# EAGLE design photo-trigger (EAGLE 6.6.0)

## Sheet 1 of 4
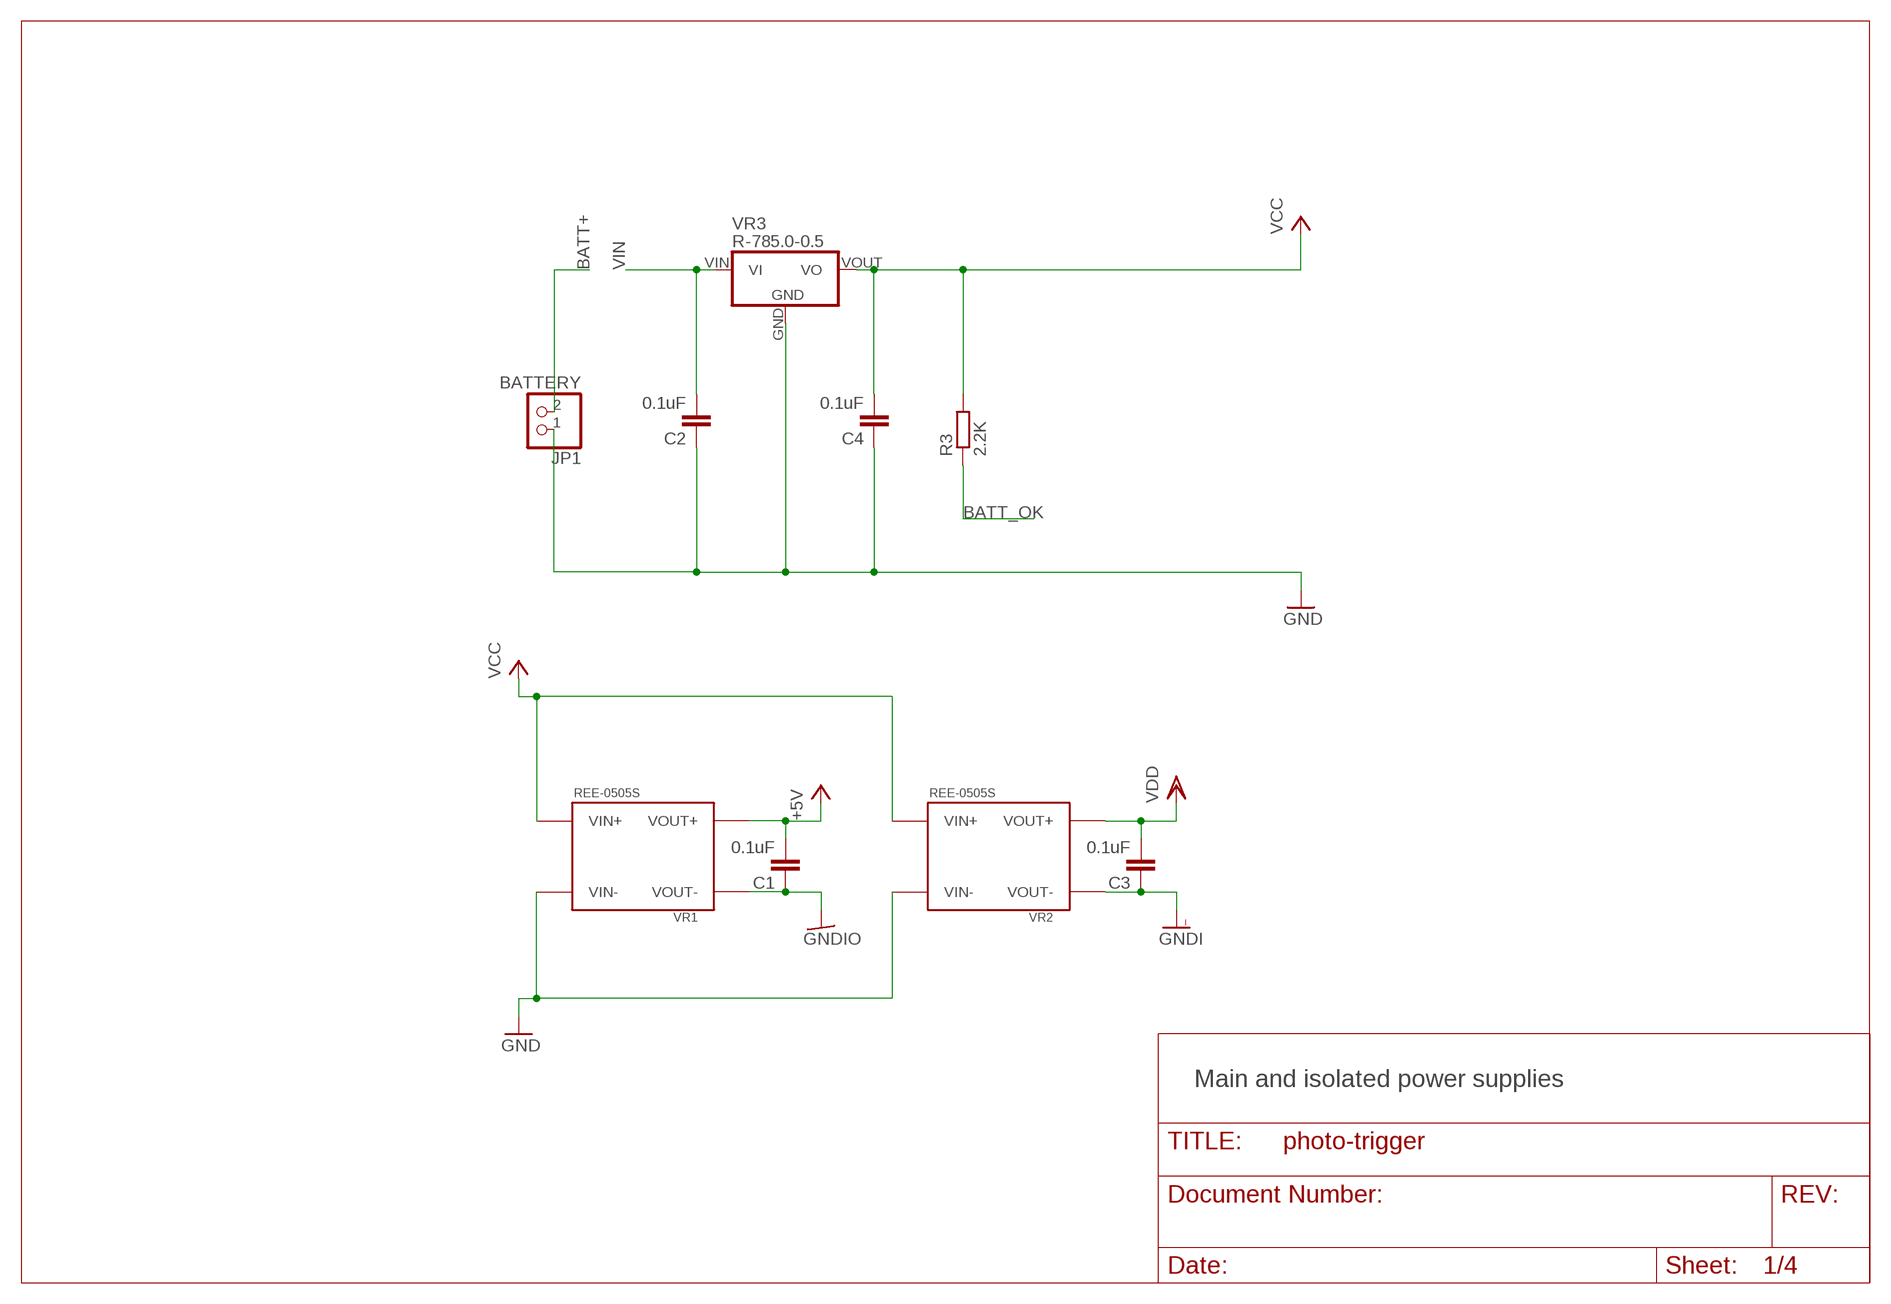
[diagram p0: schematic, sheet 1]

### Parts
C1  0.1uF  C-EU050-035X075  [C050-035X075]
C2  0.1uF  C-EU050-035X075  [C050-035X075]
C3  0.1uF  C-EU050-035X075  [C050-035X075]
C4  0.1uF  C-EU050-035X075  [C050-035X075]
JP1  BATTERY  PINHD-1X2  [1X02]
R3  2.2K  R-EU_0207/10  [0207/10]
VR1  REE-0505S  RECOM-REE-0505S  [RECOM-REE]
VR2  REE-0505S  RECOM-REE-0505S  [RECOM-REE]
VR3  R-785.0-0.5  RECOM-R-785.0-0.5  [RECOM-R78]

### Nets
+5V [power]: C1.2 VR1.VOUT+ ; also sheet 4
BATT+ [power]: JP1.2 ; also sheet 4
BATT_OK: R3.1 ; also sheet 4
GND [power]: C2.1 C4.1 JP1.1 VR1.VIN- VR2.VIN- VR3.GND ; also sheet 2,3,4
GNDI [power]: C3.1 VR2.VOUT- ; also sheet 4
GNDIO [power]: C1.1 VR1.VOUT- ; also sheet 2,4
VCC [power]: C4.2 R3.2 VR1.VIN+ VR2.VIN+ VR3.VOUT(VO) ; also sheet 2,3,4
VDD [power]: C3.2 VR2.VOUT+ ; also sheet 4
VIN [power]: C2.2 VR3.VIN(VI) ; also sheet 4

### Notes on the sheet
- Main and isolated power supplies

## Sheet 2 of 4
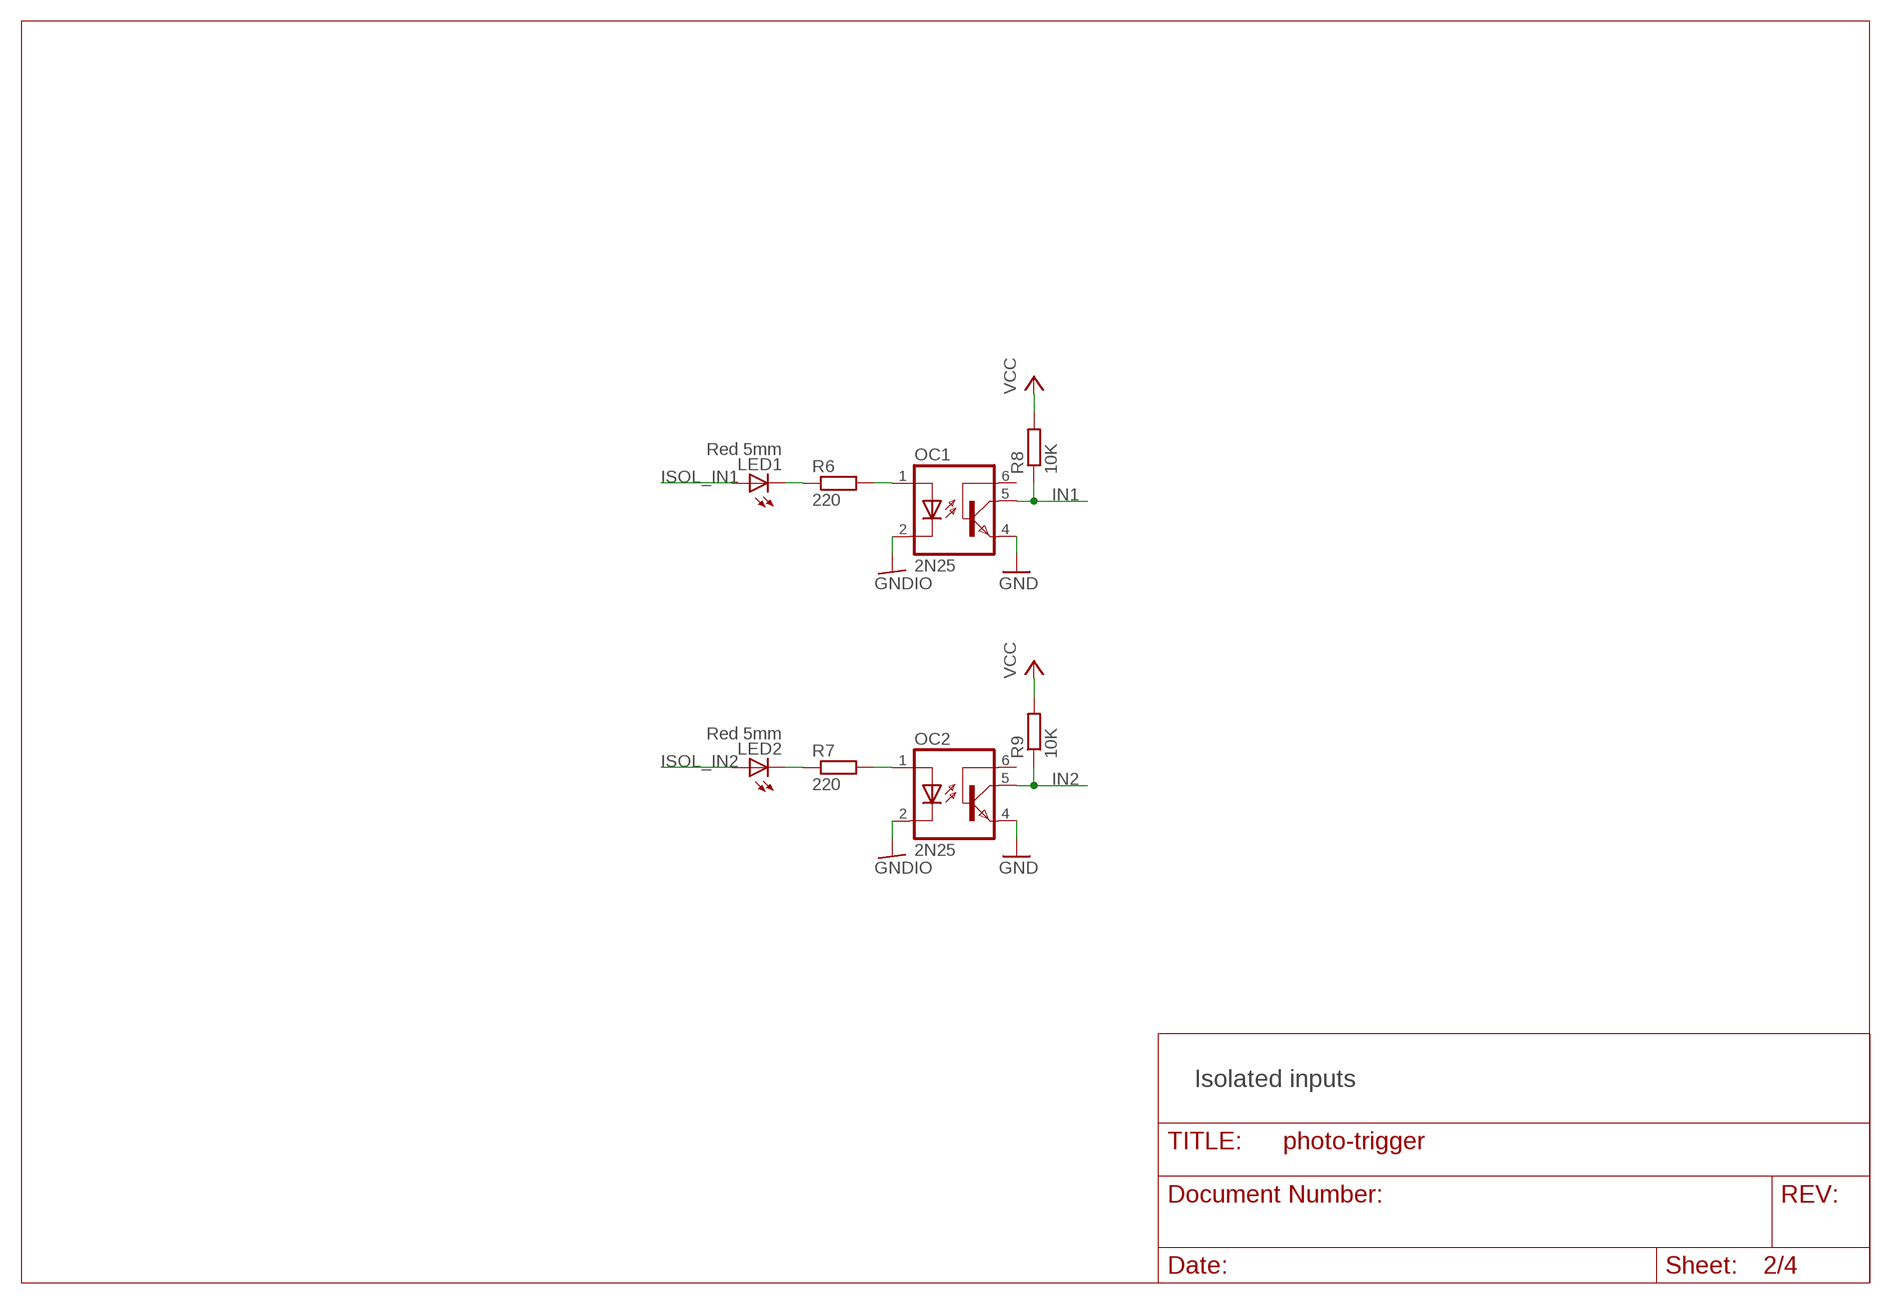
[diagram p1: schematic, sheet 2]

### Parts
LED1  Red 5mm  LED5MM  [LED5MM]
LED2  Red 5mm  LED5MM  [LED5MM]
OC1  2N25  [DIL-06]
OC2  2N25  [DIL-06]
R6  220  R-EU_0207/10  [0207/10]
R7  220  R-EU_0207/10  [0207/10]
R8  10K  R-EU_0207/10  [0207/10]
R9  10K  R-EU_0207/10  [0207/10]

### Nets
GND [power]: OC1.4(EMI) OC2.4(EMI) ; also sheet 1,3,4
GNDIO [power]: OC1.2(C) OC2.2(C) ; also sheet 1,4
IN1: OC1.5(COL) R8.1 ; also sheet 3
IN2: OC2.5(COL) R9.1 ; also sheet 3
ISOL_IN1: LED1.A ; also sheet 4
ISOL_IN2: LED2.A ; also sheet 4
N$1: OC1.1(A) R6.2
N$2: OC2.1(A) R7.2
N$3: LED2.K(C) R7.1
N$4: LED1.K(C) R6.1
VCC [power]: R8.2 R9.2 ; also sheet 1,3,4
Unconnected: OC1.6(BAS) OC2.6(BAS)

### Notes on the sheet
- Isolated inputs

## Sheet 3 of 4
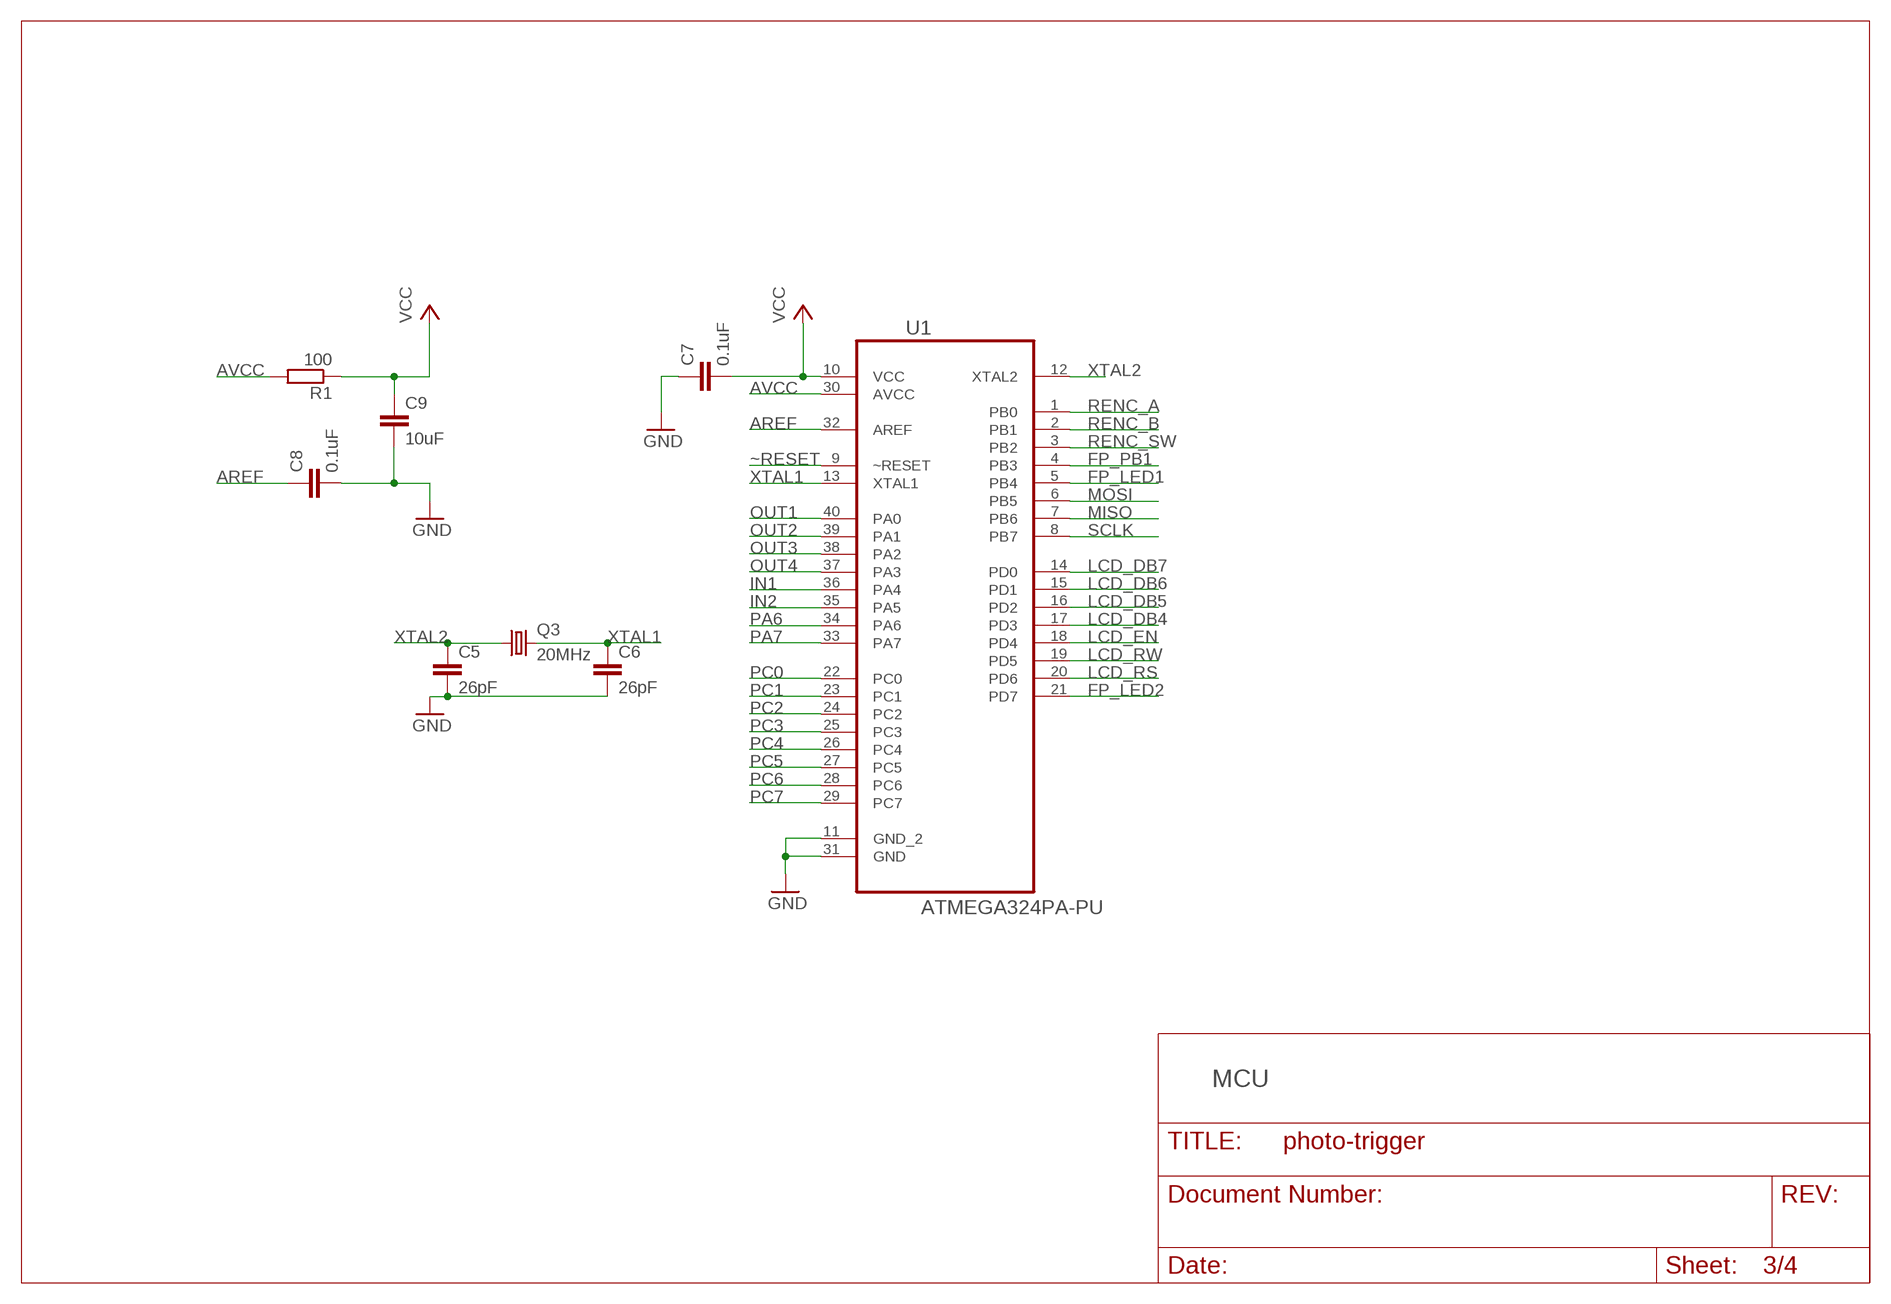
[diagram p2: schematic, sheet 3]

### Parts
C5  26pF  C-EU025-025X050  [C025-025X050]
C6  26pF  C-EU025-025X050  [C025-025X050]
C7  0.1uF  C-EU050-035X075  [C050-035X075]
C8  0.1uF  C-EU050-035X075  [C050-035X075]
C9  10uF  C-EU050-035X075  [C050-035X075]
Q3  20MHz  CRYSTALHC49S  [HC49/S]
R1  100  R-EU_0207/10  [0207/10]
U1  ATMEGA324PA-PU  [DIP254P1524X482-40]

### Nets
AREF: C8.1 U1.32(AREF)
AVCC: R1.2 U1.30(AVCC)
FP_LED1: U1.5(PB4) ; also sheet 4
FP_LED2: U1.21(PD7) ; also sheet 4
FP_PB1: U1.4(PB3) ; also sheet 4
GND [power]: C5.2 C6.2 C7.1 C8.2 C9.2 U1.11(GND_2) U1.31(GND) ; also sheet 1,2,4
IN1: U1.36(PA4) ; also sheet 2
IN2: U1.35(PA5) ; also sheet 2
LCD_DB4: U1.17(PD3) ; also sheet 4
LCD_DB5: U1.16(PD2) ; also sheet 4
LCD_DB6: U1.15(PD1) ; also sheet 4
LCD_DB7: U1.14(PD0) ; also sheet 4
LCD_EN: U1.18(PD4) ; also sheet 4
LCD_RS: U1.20(PD6) ; also sheet 4
LCD_RW: U1.19(PD5) ; also sheet 4
MISO: U1.7(PB6) ; also sheet 4
MOSI: U1.6(PB5) ; also sheet 4
OUT1: U1.40(PA0) ; also sheet 4
OUT2: U1.39(PA1) ; also sheet 4
OUT3: U1.38(PA2) ; also sheet 4
OUT4: U1.37(PA3) ; also sheet 4
PA6: U1.34(PA6) ; also sheet 4
PA7: U1.33(PA7) ; also sheet 4
PC0: U1.22(PC0) ; also sheet 4
PC1: U1.23(PC1) ; also sheet 4
PC2: U1.24(PC2) ; also sheet 4
PC3: U1.25(PC3) ; also sheet 4
PC4: U1.26(PC4) ; also sheet 4
PC5: U1.27(PC5) ; also sheet 4
PC6: U1.28(PC6) ; also sheet 4
PC7: U1.29(PC7) ; also sheet 4
RENC_A: U1.1(PB0) ; also sheet 4
RENC_B: U1.2(PB1) ; also sheet 4
RENC_SW: U1.3(PB2) ; also sheet 4
SCLK: U1.8(PB7) ; also sheet 4
VCC [power]: C7.2 C9.1 R1.1 U1.10(VCC) ; also sheet 1,2,4
XTAL1: C6.1 Q3.2 U1.13(XTAL1)
XTAL2: C5.1 Q3.1 U1.12(XTAL2)
~RESET: U1.9(~RESET) ; also sheet 4

### Notes on the sheet
- MCU

## Sheet 4 of 4
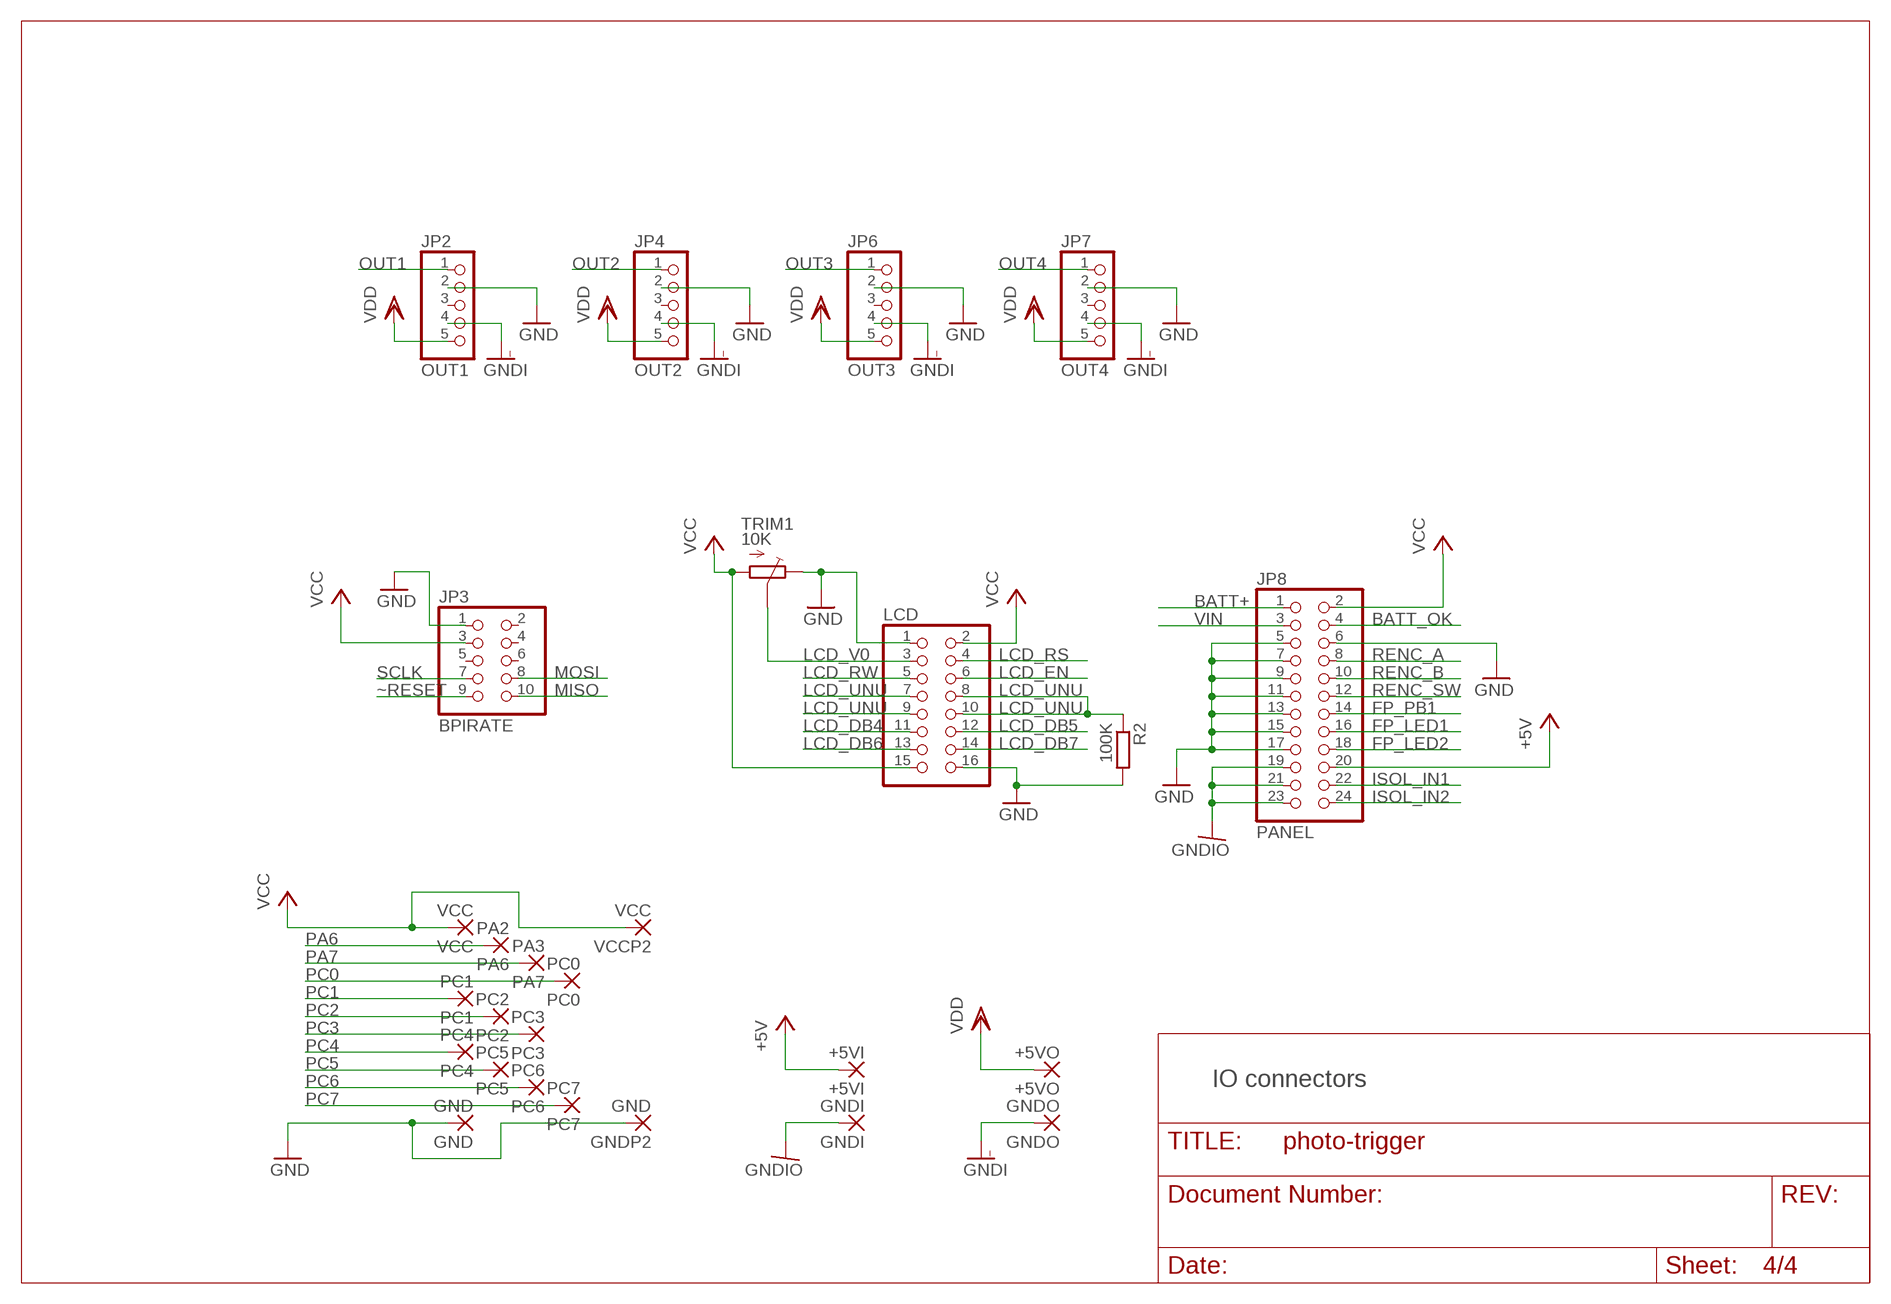
[diagram p3: schematic, sheet 4]

### Parts
+5VI  +5VI  1,6/0,9  [1,6/0,9]
+5VO  +5VO  1,6/0,9  [1,6/0,9]
GND  GND  1,6/0,9  [1,6/0,9]
GNDI  GNDI  1,6/0,9  [1,6/0,9]
GNDO  GNDO  1,6/0,9  [1,6/0,9]
GNDP2  GND  1,6/0,9  [1,6/0,9]
JP2  OUT1  PINHD-1X5  [1X05]
JP3  BPIRATE  PINHD-2X5  [2X05]
JP4  OUT2  PINHD-1X5  [1X05]
JP6  OUT3  PINHD-1X5  [1X05]
JP7  OUT4  PINHD-1X5  [1X05]
JP8  PANEL  PINHD-2X12  [2X12]
LCD  PINHD-2X8  [2X08]
PA6  PA2  1,6/0,9  [1,6/0,9]
PA7  PA3  1,6/0,9  [1,6/0,9]
PC0  PC0  1,6/0,9  [1,6/0,9]
PC1  PC1  1,6/0,9  [1,6/0,9]
PC2  PC2  1,6/0,9  [1,6/0,9]
PC3  PC3  1,6/0,9  [1,6/0,9]
PC4  PC4  1,6/0,9  [1,6/0,9]
PC5  PC5  1,6/0,9  [1,6/0,9]
PC6  PC6  1,6/0,9  [1,6/0,9]
PC7  PC7  1,6/0,9  [1,6/0,9]
R2  100K  R-EU_0207/10  [0207/10]
TRIM1  10K  VISHAY-63M-T607  [VISHAY-TRIM-63M-T607]
VCC  VCC  1,6/0,9  [1,6/0,9]
VCCP2  VCC  1,6/0,9  [1,6/0,9]

### Nets
+5V [power]: +5VI.1(P) JP8.20 ; also sheet 1
BATT+ [power]: JP8.1 ; also sheet 1
BATT_OK: JP8.4 ; also sheet 1
FP_LED1: JP8.16 ; also sheet 3
FP_LED2: JP8.18 ; also sheet 3
FP_PB1: JP8.14 ; also sheet 3
GND [power]: GND.1(P) GNDP2.1(P) JP2.2 JP3.1 JP4.2 JP6.2 JP7.2 JP8.5 JP8.6 JP8.7 JP8.9 JP8.11 JP8.13 JP8.15 JP8.17 LCD.1 LCD.16 R2.2 TRIM1.P$3(E) ; also sheet 1,2,3
GNDI [power]: GNDO.1(P) JP2.4 JP4.4 JP6.4 JP7.4 ; also sheet 1
GNDIO [power]: GNDI.1(P) JP8.19 JP8.21 JP8.23 ; also sheet 1,2
ISOL_IN1: JP8.22 ; also sheet 2
ISOL_IN2: JP8.24 ; also sheet 2
LCD_DB4: LCD.11 ; also sheet 3
LCD_DB5: LCD.12 ; also sheet 3
LCD_DB6: LCD.13 ; also sheet 3
LCD_DB7: LCD.14 ; also sheet 3
LCD_EN: LCD.6 ; also sheet 3
LCD_RS: LCD.4 ; also sheet 3
LCD_RW: LCD.5 ; also sheet 3
LCD_UNU: LCD.7 LCD.8 LCD.9 LCD.10 R2.1
LCD_V0: LCD.3 TRIM1.P$2(S)
MISO: JP3.10 ; also sheet 3
MOSI: JP3.8 ; also sheet 3
OUT1: JP2.1 ; also sheet 3
OUT2: JP4.1 ; also sheet 3
OUT3: JP6.1 ; also sheet 3
OUT4: JP7.1 ; also sheet 3
PA6: PA6.1(P) ; also sheet 3
PA7: PA7.1(P) ; also sheet 3
PC0: PC0.1(P) ; also sheet 3
PC1: PC1.1(P) ; also sheet 3
PC2: PC2.1(P) ; also sheet 3
PC3: PC3.1(P) ; also sheet 3
PC4: PC4.1(P) ; also sheet 3
PC5: PC5.1(P) ; also sheet 3
PC6: PC6.1(P) ; also sheet 3
PC7: PC7.1(P) ; also sheet 3
RENC_A: JP8.8 ; also sheet 3
RENC_B: JP8.10 ; also sheet 3
RENC_SW: JP8.12 ; also sheet 3
SCLK: JP3.7 ; also sheet 3
VCC [power]: JP3.3 JP8.2 LCD.2 LCD.15 TRIM1.P$1(A) VCC.1(P) VCCP2.1(P) ; also sheet 1,2,3
VDD [power]: +5VO.1(P) JP2.5 JP4.5 JP6.5 JP7.5 ; also sheet 1
VIN [power]: JP8.3 ; also sheet 1
~RESET: JP3.9 ; also sheet 3
Unconnected: JP2.3 JP3.2 JP3.4 JP3.5 JP3.6 JP4.3 JP6.3 JP7.3

### Notes on the sheet
- IO connectors

## Library data of the parts
+5VI +5VO GND GNDI GNDO GNDP2 PA6 PA7 PC0 PC1-PC7 VCC VCCP2 = wirepad:1,6/0,9: THROUGH-HOLE PAD
C1-C9 = rcl:C-EU: CAPACITOR, European symbol
JP1 = pinhead:PINHD-1X2: PIN HEADER
JP2 JP4 JP6 JP7 = pinhead:PINHD-1X5: PIN HEADER
JP3 = pinhead:PINHD-2X5: PIN HEADER
JP8 = pinhead:PINHD-2X12: PIN HEADER
LCD = pinhead:PINHD-2X8: PIN HEADER
LED1 LED2 = led:LED: LED OSRAM: - CHIPLED LG R971, LG N971, LY N971, LG Q971, LY Q971, LO R971, LY R971 LH N974, LH R974 LS Q976, LO Q976, LY Q976 LO Q996 - Hyper CHIPLED LW Q18S LB Q993, LB Q99A, LB R99A - SideLED LS A670, LO A670, LY A670, LG A670, LP A670 LB A673, LV A673, LT A673, LW A673 LH A674 LY A675 LS A676, LA A676, LO A676, LY A676, LW A676 LS A679, LY A679, LG A679 - Hyper Micro SIDELED® LS Y876, LA Y876, LO Y876, LY Y876 LT Y87S - SmartLED LW L88C, LW L88S LB L89C, LB L89S, LG L890 LS L89K, LO L89K, LY L89K LS L896, LA L896, LO L896, LY L896 - TOPLED LS T670, LO T670, LY T670, LG T670, LP T670 LSG T670, LSP T670, LSY T670, LOP T670, LYG T670 LG T671, LOG T671, LSG T671 LB T673, LV T673, LT T673, LW T673 LH T674 LS T676, LA T676, LO T676, LY T676, LB T676, LH T676, LSB T676, LW T676 LB T67C, LV T67C, LT T67C, LS T67K, LO T67K, LY T67K, LW E67C LS E67B, LA E67B, LO E67B, LY E67B, LB E67C, LV E67C, LT E67C LW T67C LS T679, LY T679, LG T679 LS T770, LO T770, LY T770, LG T770, LP T770 LB T773, LV T773, LT T773, LW T773 LH T774 LS E675, LA E675, LY E675, LS T675 LS T776, LA T776, LO T776, LY T776, LB T776 LHGB T686 LT T68C, LB T68C - Hyper Mini TOPLED® LB M676 - Mini TOPLED Santana® LG M470 LS M47K, LO M47K, LY M47K Source: http://www.osram.convergy.de LUXEON: - LUMILED® LXK2-PW12-R00, LXK2-PW12-S00, LXK2-PW14-U00, LXK2-PW14-V00 LXK2-PM12-R00, LXK2-PM12-S00, LXK2-PM14-U00 LXK2-PE12-Q00, LXK2-PE12-R00, LXK2-PE12-S00, LXK2-PE14-T00, LXK2-PE14-U00 LXK2-PB12-K00, LXK2-PB12-L00, LXK2-PB12-M00, LXK2-PB14-N00, LXK2-PB14-P00, LXK2-PB14-Q00 LXK2-PR12-L00, LXK2-PR12-M00, LXK2-PR14-Q00, LXK2-PR14-R00 LXK2-PD12-Q00, LXK2-PD12-R00, LXK2-PD12-S00 LXK2-PH12-R00, LXK2-PH12-S00 LXK2-PL12-P00, LXK2-PL12-Q00, LXK2-PL12-R00 Source: www.luxeon.com KINGBRIGHT: KA-3528ASYC Source: www.kingbright.com
OC1 OC2 = djm:2N25: 2N25 NPN optocoupler
Q3 = crystal:CRYSTAL: CRYSTAL; OC_FARNELL: 1667008; OC_NEWARK: unknown
R1-R3 = rcl:R-EU_: RESISTOR, European symbol
R6-R9 = resistor:R-EU_: RESISTOR, European symbol
TRIM1 = djm:VISHAY-63M-T607: Vishay Spectrol M63*T607 single-turn trimpot http://www.vishay.com/docs/57027/63.pdf
U1 = Atmel_By_element14_Batch_1-00:ATMEGA324PA-PU: 8-bit MCU; MPN: ATMEGA324PA-PU; OC_FARNELL: 1715485; OC_NEWARK: 15R0267; PACKAGE: DIP-40; SUPPLIER: ATMEL
VR1 VR2 = djm:RECOM-REE-0505S: RECOM REE-0505S Isolating DC/DC converter. Output 5VDC 200mA. Input 5VDC http://docs-asia.electrocomponents.com/webdocs/11da/0900766b811da244.pdf
VR3 = djm:RECOM-R-785.0-0.5: Recom R-785.0-0.5 Switching regulator. Output: 5V 500mA. Input 6.5-32V. http://docs-asia.electrocomponents.com/webdocs/063c/0900766b8063c4d2.pdf

## Net classes
1 power: width 1.27 mm

## Board
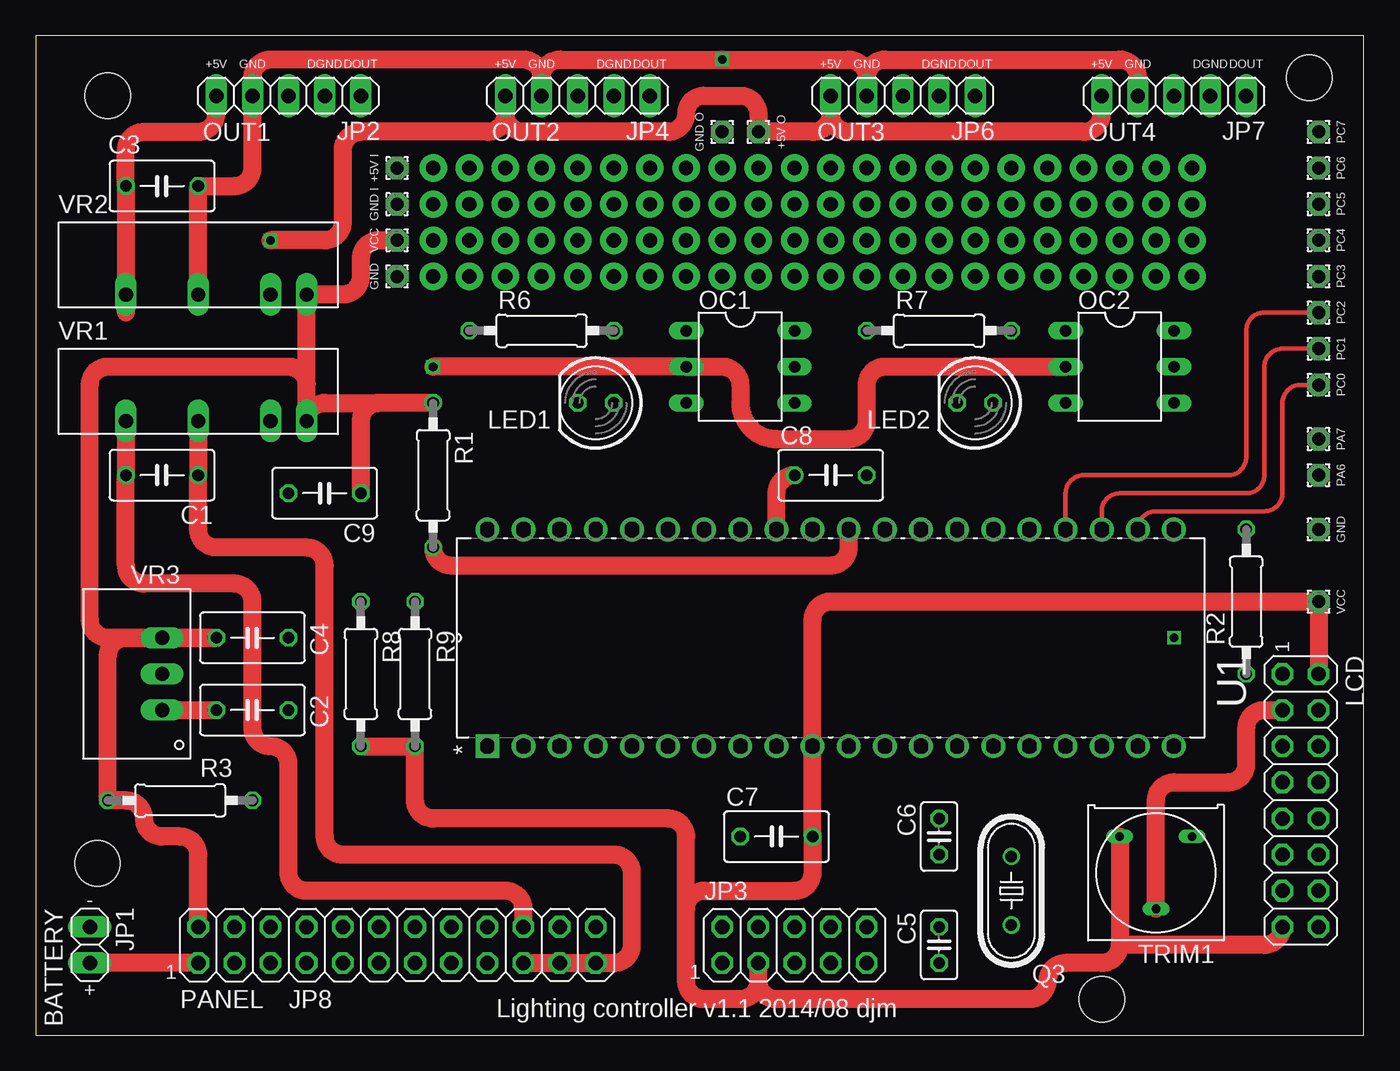
[diagram p4: board, top side]
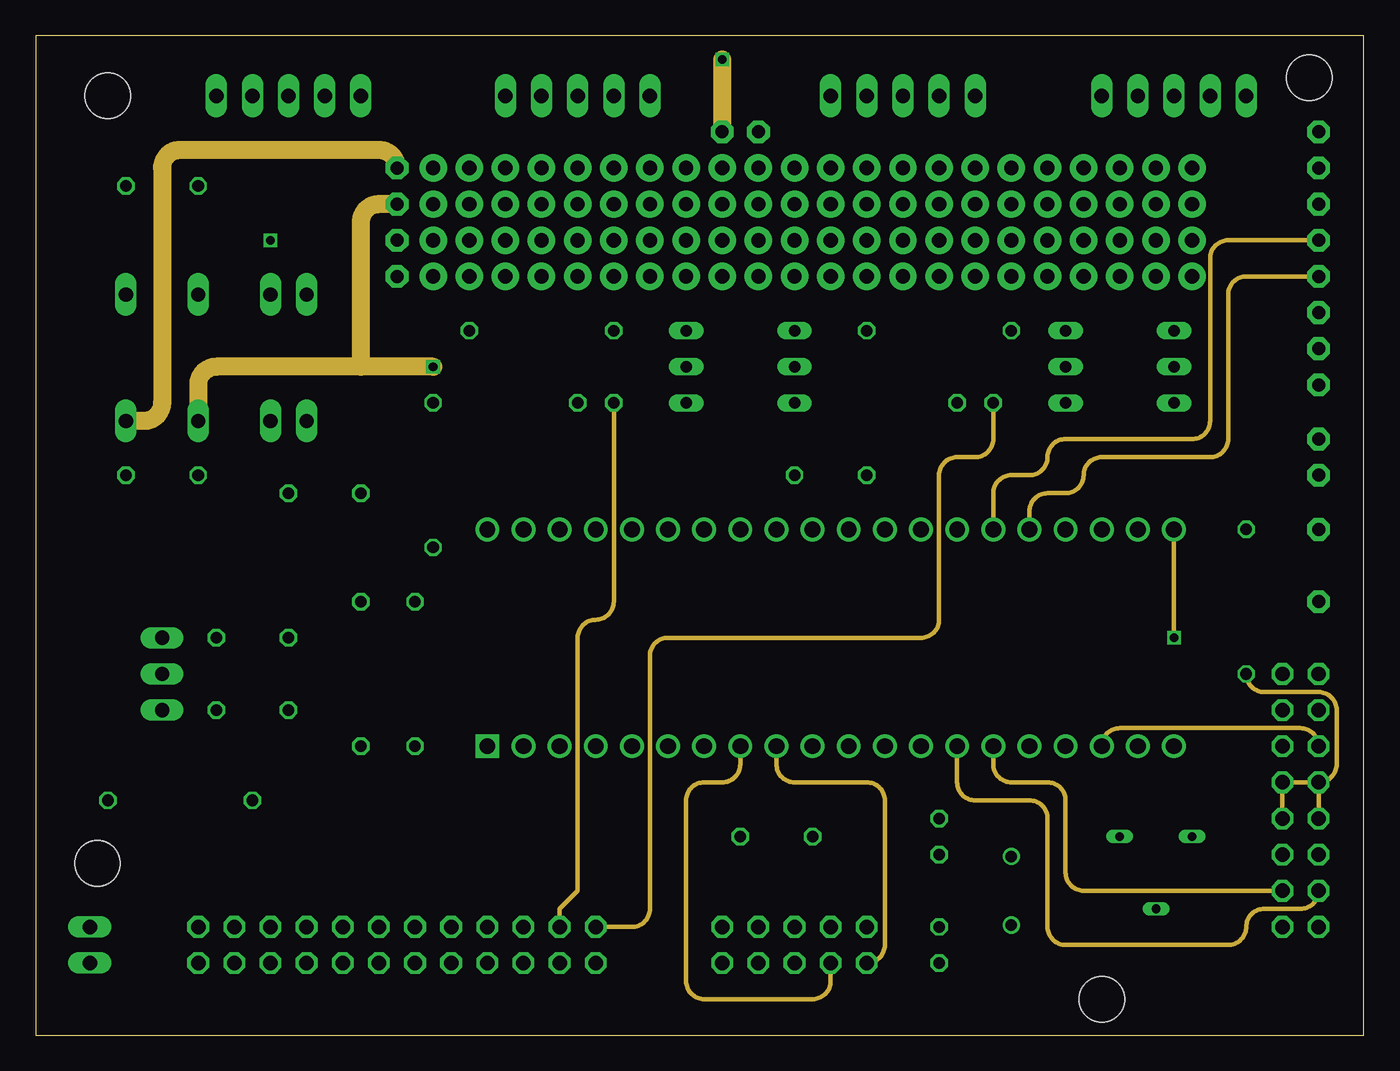
[diagram p5: board, inner layer Layer2]
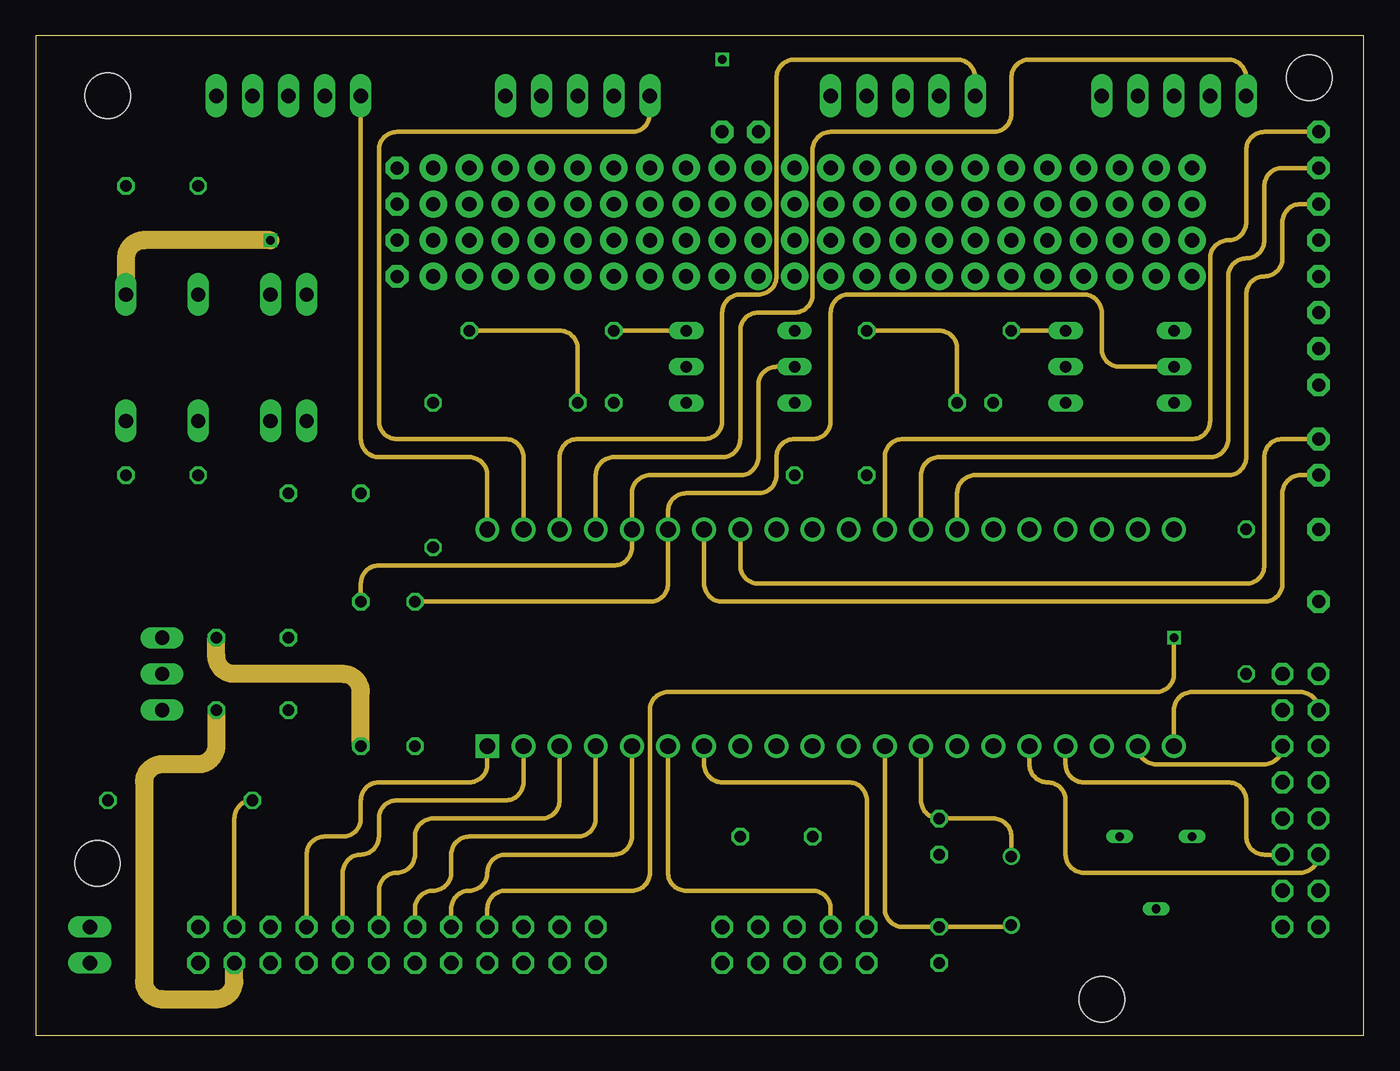
[diagram p6: board, inner layer Layer3]
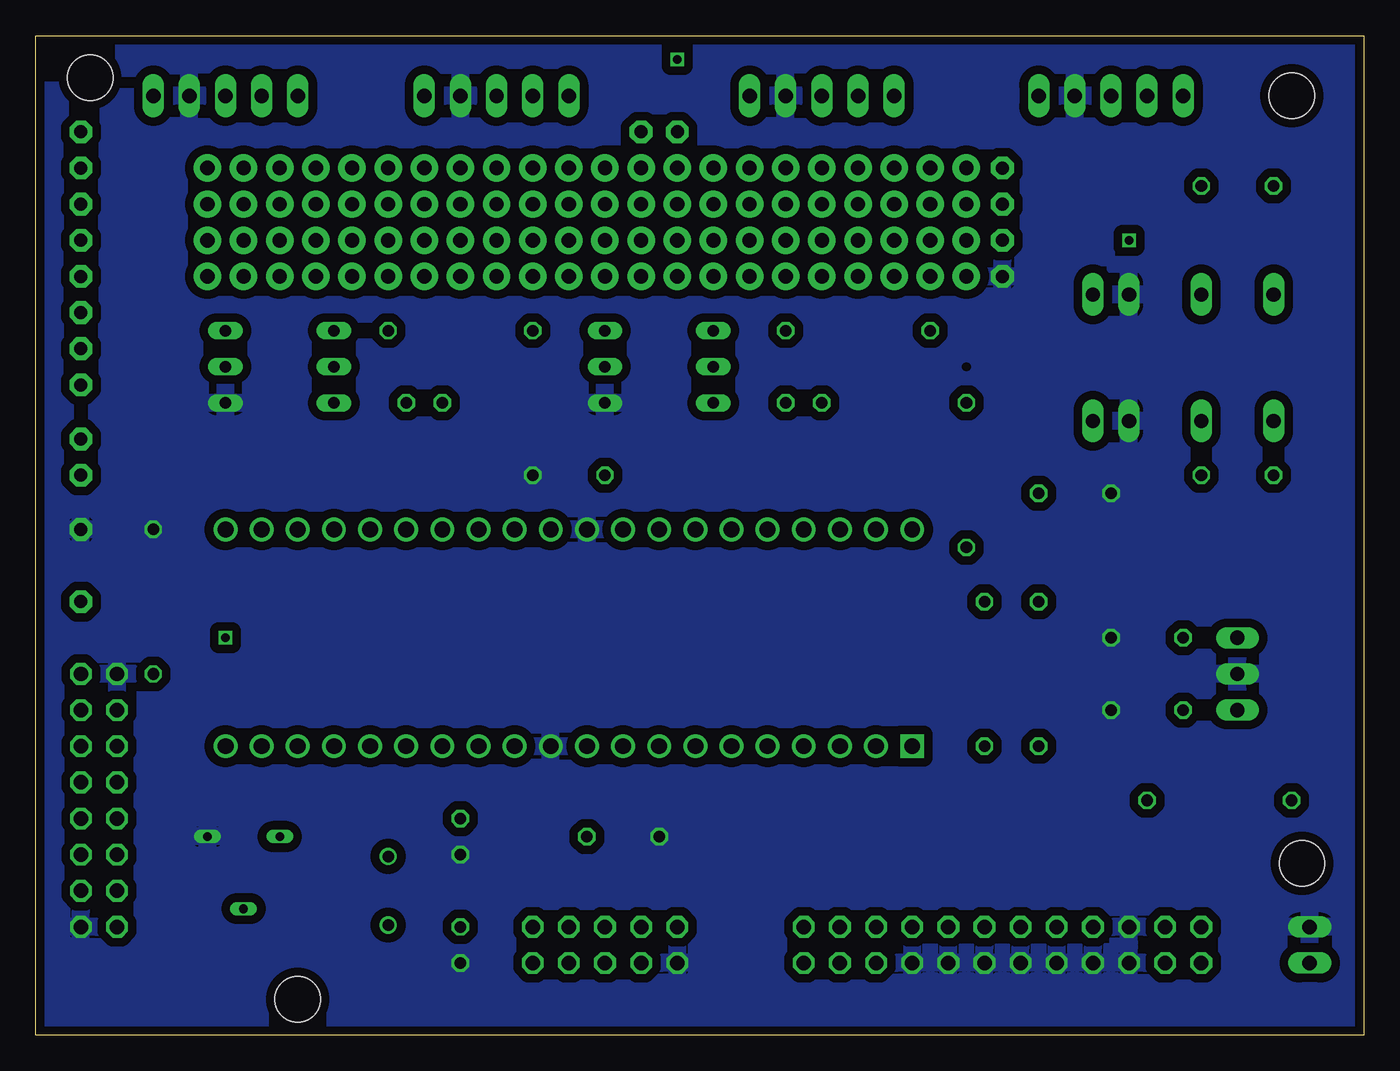
[diagram p7: board, bottom side, seen from below]

Size 93.36 x 70.27 mm. Coordinates in mm from the lower left corner, seen from the top.
Outline: 0,0 93.36,0 93.36,70.27 0,70.27 0,0
Copper layers ((1+2)*(15+16)): Top 0.035559375mm / dielectric 0.17018125mm / Layer2 0.01778125mm / dielectric 47mil / Layer3 0.01778125mm / dielectric 0.17018125mm / Bottom 0.035559375mm
Design rules "Laen_4layer_min_10mil": minimum track width 10mil, minimum drill 13mil, track to track 10mil, track to pad 10mil, pad to pad 10mil, via to via 10mil, smd to smd 6mil, copper to edge 15mil, drill to drill 10mil, minimum pad ring 7mil, minimum via ring 7mil, stop-mask expansion 3mil, vias tented up to drill 0mil, thermal gap 10mil
Holes 3.2 mm at 4.35,12.08 5.08,66.04 89.53,67.31 74.93,2.54

### Footprints (pad centres in the part's own frame; a part is rotated, then mirrored left to right if it is on the bottom)
1,6/0,9 = drill 0.914 pad 1.6 octagon: 1 0,0
C050-035X075 = drill 0.813 octagon: 1 -2.54,0; 2 2.54,0
C025-025X050 = drill 0.813 octagon: 1 -1.27,0; 2 1.27,0
1X02 = drill 1.016 long: 1 -1.27,0; 2 1.27,0
1X05 = drill 1.016 long: 1 -5.08,0; 2 -2.54,0; 3 0,0; 4 2.54,0; 5 5.08,0
2X05 = drill 1.016 octagon: 1 -5.08,-1.27; 2 -5.08,1.27; 3 -2.54,-1.27; 4 -2.54,1.27; 5 0,-1.27; 6 0,1.27; 7 2.54,-1.27; 8 2.54,1.27; 9 5.08,-1.27; 10 5.08,1.27
2X12 = drill 1.016 octagon: 1 -13.97,-1.27; 2 -13.97,1.27; 3 -11.43,-1.27; 4 -11.43,1.27; 5 -8.89,-1.27; 6 -8.89,1.27; 7 -6.35,-1.27; 8 -6.35,1.27; 9 -3.81,-1.27; 10 -3.81,1.27; 11 -1.27,-1.27; 12 -1.27,1.27; 13 1.27,-1.27; 14 1.27,1.27; 15 3.81,-1.27; 16 3.81,1.27; 17 6.35,-1.27; 18 6.35,1.27; 19 8.89,-1.27; 20 8.89,1.27; 21 11.43,-1.27; 22 11.43,1.27; 23 13.97,-1.27; 24 13.97,1.27
2X08 = drill 1.016 octagon: 1 -8.89,-1.27; 2 -8.89,1.27; 3 -6.35,-1.27; 4 -6.35,1.27; 5 -3.81,-1.27; 6 -3.81,1.27; 7 -1.27,-1.27; 8 -1.27,1.27; 9 1.27,-1.27; 10 1.27,1.27; 11 3.81,-1.27; 12 3.81,1.27; 13 6.35,-1.27; 14 6.35,1.27; 15 8.89,-1.27; 16 8.89,1.27
LED5MM = drill 0.813 octagon: A -1.27,0; K 1.27,0
DIL-06 = drill 0.813 long: 1 -2.54,-3.81; 2 0,-3.81; 3 2.54,-3.81; 4 2.54,3.81; 5 0,3.81; 6 -2.54,3.81
HC49/S = drill 0.813: 1 -2.413,0; 2 2.413,0
0207/10 = drill 0.813 octagon: 1 -5.08,0; 2 5.08,0
VISHAY-TRIM-63M-T607 = drill 0.6 long: P$1 -2.54,2.54; P$2 0,-2.54; P$3 2.54,2.54
DIP254P1524X482-40 = drill 1.118 square: 1 -15.24,48.26 | drill 1.118: 2 -15.24,45.72; 3 -15.24,43.18; 4 -15.24,40.64; 5 -15.24,38.1; 6 -15.24,35.56; 7 -15.24,33.02; 8 -15.24,30.48; 9 -15.24,27.94; 10 -15.24,25.4; 11 -15.24,22.86; 12 -15.24,20.32; 13 -15.24,17.78; 14 -15.24,15.24; 15 -15.24,12.7; 16 -15.24,10.16; 17 -15.24,7.62; 18 -15.24,5.08; 19 -15.24,2.54; 20 -15.24,0; 21 0,0; 22 0,2.54; 23 0,5.08; 24 0,7.62; 25 0,10.16; 26 0,12.7; 27 0,15.24; 28 0,17.78; 29 0,20.32; 30 0,22.86; 31 0,25.4; 32 0,27.94; 33 0,30.48; 34 0,33.02; 35 0,35.56; 36 0,38.1; 37 0,40.64; 38 0,43.18; 39 0,45.72; 40 0,48.26
RECOM-REE = drill 1 long: VIN+ -7.62,0; VIN- -5.08,0; VOUT+ 5.08,0; VOUT- 0,0
RECOM-R78 = drill 1 long: GND 0,0; VIN -2.54,0; VOUT 2.54,0

### Placement (x,y rotation side)
+5VI  25.4,60.96 0 top
+5VO  50.8,63.5 0 top
C1  8.89,39.37 180 top
C2  15.24,22.86 180 top
C3  8.89,59.69 180 top
C4  15.24,27.94 180 top
C5  63.5,6.35 270 top
C6  63.5,13.97 270 top
C7  52.07,13.97 0 top
C8  55.88,39.37 0 top
C9  20.32,38.1 180 top
GND  90.17,35.56 270 top
GNDI  25.4,58.42 90 top
GNDO  48.26,63.5 0 top
GNDP2  25.4,53.34 0 top
JP1  3.81,6.35 270 top
JP2  17.78,66.04 180 top
JP3  53.34,6.35 0 top
JP4  38.1,66.04 180 top
JP6  60.96,66.04 180 top
JP7  80.01,66.04 180 top
JP8  25.4,6.35 0 top
LCD  88.9,16.51 270 top
LED1  39.37,44.45 180 top
LED2  66.04,44.45 180 top
OC1  49.53,46.99 270 top
OC2  76.2,46.99 270 top
PA6  90.17,39.37 270 top
PA7  90.17,41.91 270 top
PC0  90.17,45.72 270 top
PC1  90.17,48.26 270 top
PC2  90.17,50.8 270 top
PC3  90.17,53.34 270 top
PC4  90.17,55.88 270 top
PC5  90.17,58.42 270 top
PC6  90.17,60.96 270 top
PC7  90.17,63.5 270 top
Q3  68.58,10.16 90 top
R1  27.94,39.37 270 top
R2  85.09,30.48 90 top
R3  10.16,16.51 180 top
R6  35.56,49.53 0 top
R7  63.5,49.53 0 top
R8  22.86,25.4 270 top
R9  26.67,25.4 270 top
TRIM1  78.74,11.43 0 top
U1  80.01,35.56 90 top
VCC  90.17,30.48 270 top
VCCP2  25.4,55.88 0 top
VR1  11.43,43.18 180 top
VR2  11.43,52.07 180 top
VR3  8.89,25.4 90 top

### Tracks (layer width: path | path; a pad name or v marks a point on that pad's centre or on a via)
+5V
  Top 1.27: VR1.VOUT+ C1.2 6.35,33.02 arc90 7.62,31.75 13.97,31.75 arc-90 15.24,30.48 15.24,21.59 arc90 16.51,20.32 arc-90 17.78,19.05 17.78,11.43 arc90 19.05,10.16 33.02,10.16 arc-90 34.29,8.89 JP8.20
  Layer2 1.27: +5VI.1 arc90 24.13,62.23 10.16,62.23 arc90 8.89,60.96 8.89,44.45 arc-90 7.62,43.18 VR1.VOUT+
AREF
  Top 1.27: U1.32 52.07,38.1 arc-90 C8.1
AVCC
  Top 1.27: R1.2 arc90 29.21,33.02 55.88,33.02 arc90 57.15,34.29 U1.30
BATT+
  Top 1.27: JP8.1 JP1.2
BATT_OK
  Layer3 0.305: JP8.4 13.97,15.24 arc-90 R3.1
FP_LED1
  Layer3 0.305: JP8.16 29.21,8.89 arc-90 30.48,10.16 arc90 31.75,11.43 arc-90 33.02,12.7 40.64,12.7 arc90 41.91,13.97 U1.5
FP_LED2  (via drill 0.6)
  Layer2 0.305: v80.01,27.94 U1.21
  Layer3 0.305: JP8.18 31.75,8.89 arc-90 33.02,10.16 41.91,10.16 arc90 43.18,11.43 43.18,22.86 arc-90 44.45,24.13 78.74,24.13 arc90 80.01,25.4 v80.01,27.94
FP_PB1
  Layer3 0.305: JP8.14 26.67,8.89 arc-90 27.94,10.16 arc90 29.21,11.43 29.21,12.7 arc-90 30.48,13.97 38.1,13.97 arc90 39.37,15.24 U1.4
GND
  pour Bottom (isolate 0.61): 0,69.85 92.71,69.85 93.98,0 2.54,0 0,1.27
GNDI  (via drill 0.6)
  Top 1.27: 35.56,67.31 arc-90 36.83,68.58 v48.26,68.58 57.15,68.58 arc-90 58.42,67.31 | 58.42,67.31 arc-90 59.69,68.58 76.2,68.58 arc-90 77.47,67.31 JP7.4 | JP4.4 35.56,67.31 | 35.56,67.31 arc90 34.29,68.58 16.51,68.58 arc90 15.24,67.31 JP2.4 15.24,60.96 arc-90 13.97,59.69 C3.1 VR2.VOUT- | JP6.4 58.42,67.31
  Layer2 1.27: v48.26,68.58 GNDO.1
GNDIO  (via drill 0.6 layers 1-2)
  Top 1.27: VR1.VOUT- C1.1 11.43,35.56 arc90 12.7,34.29 19.05,34.29 arc-90 20.32,33.02 20.32,13.97 arc90 21.59,12.7 40.64,12.7 arc-90 41.91,11.43 41.91,6.35 arc-90 40.64,5.08 JP8.23 | JP8.23 JP8.21 JP8.19 JP8.23 | v27.94,46.99 OC1.2 48.26,46.99 arc-90 49.53,45.72 49.53,44.45 arc90 52.07,41.91 57.15,41.91 arc90 58.42,43.18 58.42,45.72 arc-90 59.69,46.99 OC2.2
  Layer2 1.27: VR1.VOUT- 11.43,45.72 arc-90 12.7,46.99 22.86,46.99 | v27.94,46.99 22.86,46.99 | GNDI.1 24.13,58.42 arc90 22.86,57.15 22.86,46.99
IN1
  Layer3 0.305: OC1.5 52.07,46.99 arc90 50.8,45.72 50.8,40.64 arc-90 49.53,39.37 43.18,39.37 arc90 41.91,38.1 U1.36 41.91,34.29 arc-90 40.64,33.02 24.13,33.02 arc90 22.86,31.75 R8.1
IN2
  Layer3 0.305: OC2.5 76.2,46.99 arc-90 74.93,48.26 74.93,50.8 arc90 73.66,52.07 57.15,52.07 arc90 55.88,50.8 55.88,43.18 arc-90 54.61,41.91 53.34,41.91 arc90 52.07,40.64 52.07,39.37 arc-90 50.8,38.1 45.72,38.1 arc90 44.45,36.83 U1.35 44.45,31.75 arc-90 43.18,30.48 R9.1
ISOL_IN1
  Layer2 0.305: LED1.A 40.64,30.48 arc-90 39.37,29.21 arc90 38.1,27.94 38.1,10.16 36.83,8.89 JP8.22
ISOL_IN2
  Layer2 0.305: LED2.A 67.31,41.91 arc-90 66.04,40.64 64.77,40.64 arc90 63.5,39.37 63.5,29.21 arc-90 62.23,27.94 44.45,27.94 arc90 43.18,26.67 43.18,8.89 arc-90 41.91,7.62 JP8.24
LCD_DB4
  Layer3 0.305: U1.17 72.39,19.05 arc90 73.66,17.78 83.82,17.78 arc-90 85.09,16.51 85.09,13.97 arc90 86.36,12.7 LCD.11
LCD_DB5
  Layer3 0.305: LCD.12 arc-90 88.9,11.43 73.66,11.43 arc-90 72.39,12.7 72.39,16.51 arc90 71.12,17.78 arc-90 69.85,19.05 U1.16
LCD_DB6
  Layer2 0.305: U1.15 67.31,19.05 arc90 68.58,17.78 71.12,17.78 arc-90 72.39,16.51 72.39,11.43 arc90 73.66,10.16 LCD.13
LCD_DB7
  Layer2 0.305: U1.14 64.77,17.78 arc90 66.04,16.51 69.85,16.51 arc-90 71.12,15.24 71.12,7.62 arc90 72.39,6.35 83.82,6.35 arc90 85.09,7.62 arc-90 86.36,8.89 88.9,8.89 arc90 LCD.14
LCD_EN
  Layer2 0.305: U1.18 arc-90 76.2,21.59 88.9,21.59 arc-90 LCD.6
LCD_RS
  Layer3 0.305: U1.20 80.01,22.86 arc-90 81.28,24.13 88.9,24.13 arc-90 LCD.4
LCD_RW
  Layer3 0.305: U1.19 arc90 78.74,19.05 86.36,19.05 arc90 LCD.5
LCD_UNU
  Layer2 0.305: R2.1 arc90 86.36,24.13 90.17,24.13 arc-90 91.44,22.86 91.44,19.05 arc-90 LCD.8 | LCD.8 LCD.10 | LCD.9 LCD.7 LCD.8
LCD_V0
  Top 1.27: TRIM1.P$2 78.74,16.51 arc-90 80.01,17.78 83.82,17.78 arc90 85.09,19.05 85.09,21.59 arc-90 86.36,22.86 LCD.3
MISO
  Layer3 0.305: U1.7 46.99,19.05 arc90 48.26,17.78 57.15,17.78 arc-90 58.42,16.51 JP3.10
MOSI
  Layer3 0.305: JP3.8 55.88,8.89 arc90 54.61,10.16 45.72,10.16 arc-90 44.45,11.43 U1.6
N$1
  Layer3 0.305: R6.2 OC1.1
N$2
  Layer3 0.305: R7.2 OC2.1
N$3
  Layer3 0.305: LED2.K 64.77,48.26 arc90 63.5,49.53 R7.1
N$4
  Layer3 0.305: R6.1 36.83,49.53 arc-90 38.1,48.26 LED1.K
N$5  (via drill 1 pad 1.93)
  other vias: 58.42,58.42
N$6  (via drill 1 pad 1.93)
  other vias: 27.94,58.42
N$7  (via drill 1 pad 1.93)
  other vias: 60.96,58.42
N$8  (via drill 1 pad 1.93)
  other vias: 63.5,58.42
N$9  (via drill 1 pad 1.93)
  other vias: 66.04,58.42
N$10  (via drill 1 pad 1.93)
  other vias: 68.58,58.42
N$11  (via drill 1 pad 1.93)
  other vias: 71.12,58.42
N$12  (via drill 1 pad 1.93)
  other vias: 73.66,58.42
N$13  (via drill 1 pad 1.93)
  other vias: 76.2,58.42
N$14  (via drill 1 pad 1.93)
  other vias: 81.28,60.96
N$15  (via drill 1 pad 1.93)
  other vias: 30.48,58.42
N$16  (via drill 1 pad 1.93)
  other vias: 76.2,55.88
N$17  (via drill 1 pad 1.93)
  other vias: 73.66,55.88
N$18  (via drill 1 pad 1.93)
  other vias: 71.12,55.88
N$19  (via drill 1 pad 1.93)
  other vias: 68.58,55.88
N$20  (via drill 1 pad 1.93)
  other vias: 33.02,58.42
N$21  (via drill 1 pad 1.93)
  other vias: 35.56,58.42
N$22  (via drill 1 pad 1.93)
  other vias: 38.1,58.42
N$23  (via drill 1 pad 1.93)
  other vias: 66.04,55.88
N$24  (via drill 1 pad 1.93)
  other vias: 63.5,55.88
N$25  (via drill 1 pad 1.93)
  other vias: 60.96,55.88
N$26  (via drill 1 pad 1.93)
  other vias: 58.42,55.88
N$27  (via drill 1 pad 1.93)
  other vias: 40.64,58.42
N$28  (via drill 1 pad 1.93)
  other vias: 58.42,53.34
N$29  (via drill 1 pad 1.93)
  other vias: 60.96,53.34
N$30  (via drill 1 pad 1.93)
  other vias: 63.5,53.34
N$31  (via drill 1 pad 1.93)
  other vias: 66.04,53.34
N$32  (via drill 1 pad 1.93)
  other vias: 68.58,53.34
N$33  (via drill 1 pad 1.93)
  other vias: 71.12,53.34
N$34  (via drill 1 pad 1.93)
  other vias: 73.66,53.34
N$35  (via drill 1 pad 1.93)
  other vias: 76.2,53.34
N$36  (via drill 1 pad 1.93)
  other vias: 43.18,58.42
N$37  (via drill 1 pad 1.93)
  other vias: 45.72,58.42
N$38  (via drill 1 pad 1.93)
  other vias: 76.2,60.96
N$39  (via drill 1 pad 1.93)
  other vias: 71.12,60.96
N$40  (via drill 1 pad 1.93)
  other vias: 73.66,60.96
N$41  (via drill 1 pad 1.93)
  other vias: 55.88,60.96
N$42  (via drill 1 pad 1.93)
  other vias: 58.42,60.96
N$43  (via drill 1 pad 1.93)
  other vias: 48.26,58.42
N$44  (via drill 1 pad 1.93)
  other vias: 60.96,60.96
N$45  (via drill 1 pad 1.93)
  other vias: 63.5,60.96
N$46  (via drill 1 pad 1.93)
  other vias: 66.04,60.96
N$47  (via drill 1 pad 1.93)
  other vias: 68.58,60.96
N$48  (via drill 1 pad 1.93)
  other vias: 55.88,58.42
N$49  (via drill 1 pad 1.93)
  other vias: 55.88,55.88
N$50  (via drill 1 pad 1.93)
  other vias: 55.88,53.34
N$51  (via drill 1 pad 1.93)
  other vias: 78.74,53.34
N$52  (via drill 1 pad 1.93)
  other vias: 78.74,55.88
N$53  (via drill 1 pad 1.93)
  other vias: 78.74,58.42
N$54  (via drill 1 pad 1.93)
  other vias: 78.74,60.96
N$55  (via drill 1 pad 1.93)
  other vias: 81.28,53.34
N$56  (via drill 1 pad 1.93)
  other vias: 50.8,58.42
N$57  (via drill 1 pad 1.93)
  other vias: 81.28,55.88
N$58  (via drill 1 pad 1.93)
  other vias: 81.28,58.42
N$59  (via drill 1 pad 1.93)
  other vias: 53.34,58.42
N$60  (via drill 1 pad 1.93)
  other vias: 50.8,55.88
N$61  (via drill 1 pad 1.93)
  other vias: 53.34,55.88
N$62  (via drill 1 pad 1.93)
  other vias: 48.26,55.88
N$63  (via drill 1 pad 1.93)
  other vias: 45.72,55.88
N$64  (via drill 1 pad 1.93)
  other vias: 43.18,55.88
N$65  (via drill 1 pad 1.93)
  other vias: 40.64,55.88
N$66  (via drill 1 pad 1.93)
  other vias: 38.1,55.88
N$67  (via drill 1 pad 1.93)
  other vias: 35.56,55.88
N$68  (via drill 1 pad 1.93)
  other vias: 33.02,55.88
N$69  (via drill 1 pad 1.93)
  other vias: 27.94,55.88
N$70  (via drill 1 pad 1.93)
  other vias: 30.48,55.88
N$71  (via drill 1 pad 1.93)
  other vias: 27.94,53.34
N$72  (via drill 1 pad 1.93)
  other vias: 30.48,53.34
N$73  (via drill 1 pad 1.93)
  other vias: 33.02,53.34
N$74  (via drill 1 pad 1.93)
  other vias: 35.56,53.34
N$75  (via drill 1 pad 1.93)
  other vias: 38.1,53.34
N$76  (via drill 1 pad 1.93)
  other vias: 40.64,53.34
N$77  (via drill 1 pad 1.93)
  other vias: 43.18,53.34
N$78  (via drill 1 pad 1.93)
  other vias: 45.72,53.34
N$79  (via drill 1 pad 1.93)
  other vias: 48.26,53.34
N$80  (via drill 1 pad 1.93)
  other vias: 50.8,53.34
N$81  (via drill 1 pad 1.93)
  other vias: 53.34,53.34
N$82  (via drill 1 pad 1.93)
  other vias: 50.8,60.96
N$83  (via drill 1 pad 1.93)
  other vias: 48.26,60.96
N$84  (via drill 1 pad 1.93)
  other vias: 27.94,60.96
N$85  (via drill 1 pad 1.93)
  other vias: 30.48,60.96
N$86  (via drill 1 pad 1.93)
  other vias: 33.02,60.96
N$87  (via drill 1 pad 1.93)
  other vias: 35.56,60.96
N$88  (via drill 1 pad 1.93)
  other vias: 38.1,60.96
N$89  (via drill 1 pad 1.93)
  other vias: 40.64,60.96
N$90  (via drill 1 pad 1.93)
  other vias: 43.18,60.96
N$91  (via drill 1 pad 1.93)
  other vias: 45.72,60.96
N$92  (via drill 1 pad 1.93)
  other vias: 53.34,60.96
OUT1
  Layer3 0.305: U1.40 31.75,39.37 arc90 30.48,40.64 24.13,40.64 arc-90 22.86,41.91 JP2.1
OUT2
  Layer3 0.305: U1.39 34.29,40.64 arc90 33.02,41.91 25.4,41.91 arc-90 24.13,43.18 24.13,62.23 arc-90 25.4,63.5 41.91,63.5 arc90 43.18,64.77 JP4.1
OUT3
  Layer3 0.305: JP6.1 66.04,67.31 arc90 64.77,68.58 53.34,68.58 arc90 52.07,67.31 52.07,53.34 arc-90 50.8,52.07 49.53,52.07 arc90 48.26,50.8 48.26,43.18 arc-90 46.99,41.91 38.1,41.91 arc90 36.83,40.64 U1.38
OUT4
  Layer3 0.305: U1.37 39.37,39.37 arc-90 40.64,40.64 48.26,40.64 arc90 49.53,41.91 49.53,49.53 arc-90 50.8,50.8 53.34,50.8 arc90 54.61,52.07 54.61,62.23 arc-90 55.88,63.5 67.31,63.5 arc90 68.58,64.77 68.58,67.31 arc-90 69.85,68.58 83.82,68.58 arc-90 85.09,67.31 JP7.1
PA6
  Layer3 0.305: U1.34 46.99,31.75 arc90 48.26,30.48 86.36,30.48 arc90 87.63,31.75 87.63,38.1 arc-90 88.9,39.37 PA6.1
PA7
  Layer3 0.305: PA7.1 87.63,41.91 arc90 86.36,40.64 86.36,33.02 arc-90 85.09,31.75 50.8,31.75 arc-90 49.53,33.02 U1.33
PC0
  Top 0.305: U1.22 arc-90 78.74,36.83 86.36,36.83 arc90 87.63,38.1 87.63,44.45 arc-90 88.9,45.72 PC0.1
PC1
  Top 0.305: PC1.1 87.63,48.26 arc90 86.36,46.99 86.36,39.37 arc-90 85.09,38.1 76.2,38.1 arc90 74.93,36.83 U1.23
PC2
  Top 0.305: U1.24 72.39,38.1 arc-90 73.66,39.37 83.82,39.37 arc90 85.09,40.64 85.09,49.53 arc-90 86.36,50.8 PC2.1
PC3
  Layer2 0.305: U1.25 69.85,36.83 arc-90 71.12,38.1 72.39,38.1 arc90 73.66,39.37 arc-90 74.93,40.64 82.55,40.64 arc90 83.82,41.91 83.82,52.07 arc-90 85.09,53.34 PC3.1
PC4
  Layer2 0.305: U1.26 67.31,38.1 arc-90 68.58,39.37 69.85,39.37 arc90 71.12,40.64 arc-90 72.39,41.91 81.28,41.91 arc90 82.55,43.18 82.55,54.61 arc-90 83.82,55.88 PC4.1
PC5
  Layer3 0.305: U1.27 64.77,38.1 arc-90 66.04,39.37 83.82,39.37 arc90 85.09,40.64 85.09,52.07 arc-90 86.36,53.34 arc90 87.63,54.61 87.63,57.15 arc-90 88.9,58.42 PC5.1
PC6
  Layer3 0.305: U1.28 62.23,39.37 arc-90 63.5,40.64 82.55,40.64 arc90 83.82,41.91 83.82,53.34 arc-90 85.09,54.61 arc90 86.36,55.88 86.36,59.69 arc-90 87.63,60.96 PC6.1
PC7
  Layer3 0.305: U1.29 59.69,40.64 arc-90 60.96,41.91 81.28,41.91 arc90 82.55,43.18 82.55,54.61 arc-90 83.82,55.88 arc90 85.09,57.15 85.09,62.23 arc-90 86.36,63.5 PC7.1
RENC_A
  Layer3 0.305: U1.1 31.75,19.05 arc-90 30.48,17.78 24.13,17.78 arc90 22.86,16.51 22.86,15.24 arc-90 21.59,13.97 20.32,13.97 arc90 19.05,12.7 JP8.8
RENC_B
  Layer3 0.305: JP8.10 21.59,11.43 arc-90 22.86,12.7 arc90 24.13,13.97 24.13,15.24 arc-90 25.4,16.51 33.02,16.51 arc90 34.29,17.78 U1.2
RENC_SW
  Layer3 0.305: JP8.12 24.13,10.16 arc-90 25.4,11.43 arc90 26.67,12.7 26.67,13.97 arc-90 27.94,15.24 35.56,15.24 arc90 36.83,16.51 U1.3
SCLK
  Layer2 0.305: U1.8 49.53,19.05 arc-90 48.26,17.78 46.99,17.78 arc90 45.72,16.51 45.72,3.81 arc90 46.99,2.54 54.61,2.54 arc90 55.88,3.81 JP3.7
VCC
  Top 1.27: 19.05,45.72 VR1.VIN+ arc-90 20.32,44.45 24.13,44.45 | 19.05,45.72 VR2.VIN+ 21.59,52.07 arc90 22.86,53.34 22.86,54.61 arc-90 24.13,55.88 VCCP2.1 | R8.2 R9.2 26.67,16.51 arc90 27.94,15.24 44.45,15.24 arc-90 45.72,13.97 45.72,8.89 | 19.05,45.72 arc90 17.78,46.99 5.08,46.99 arc90 3.81,45.72 3.81,29.21 arc90 5.08,27.94 C4.2 VR3.VOUT 6.35,27.94 arc90 5.08,26.67 R3.2 6.35,16.51 arc-90 7.62,15.24 arc90 8.89,13.97 10.16,13.97 arc-90 11.43,12.7 JP8.2 | 50.8,3.81 arc-90 49.53,2.54 46.99,2.54 arc-90 45.72,3.81 45.72,8.89 | 45.72,8.89 arc-90 46.99,10.16 53.34,10.16 arc90 54.61,11.43 C7.2 U1.10 54.61,29.21 arc-90 55.88,30.48 VCC.1 LCD.2 | R1.1 24.13,44.45 | 24.13,44.45 arc90 22.86,43.18 C9.1 | TRIM1.P$1 76.2,6.35 | 76.2,6.35 arc-90 74.93,5.08 72.39,5.08 arc90 71.12,3.81 arc-90 69.85,2.54 52.07,2.54 arc-90 50.8,3.81 | 50.8,3.81 JP3.3 | LCD.15 arc-90 86.36,6.35 76.2,6.35
  Layer3 1.27: R8.2 22.86,24.13 arc90 21.59,25.4 13.97,25.4 arc-90 12.7,26.67 C4.2
VDD  (via drill 0.6)
  Top 1.27: 55.88,64.77 arc90 57.15,63.5 73.66,63.5 arc90 74.93,64.77 JP7.5 | JP2.5 12.7,64.77 arc-90 11.43,63.5 7.62,63.5 arc90 6.35,62.23 C3.2 VR2.VOUT+ 6.35,50.8 | JP6.5 55.88,64.77 | 55.88,64.77 arc-90 54.61,63.5 +5VO.1 50.8,64.77 arc90 49.53,66.04 46.99,66.04 arc90 45.72,64.77 arc-90 44.45,63.5 34.29,63.5 arc-90 33.02,64.77 | JP4.5 33.02,64.77 | 33.02,64.77 arc-90 31.75,63.5 22.86,63.5 arc90 21.59,62.23 21.59,57.15 arc-90 20.32,55.88 v16.51,55.88
  Layer3 1.27: v16.51,55.88 7.62,55.88 arc90 6.35,54.61 VR2.VOUT+
VIN
  Top 1.27: VR3.VIN C2.2
  Layer3 1.27: C2.2 12.7,20.32 arc-90 11.43,19.05 8.89,19.05 arc90 7.62,17.78 7.62,3.81 arc90 8.89,2.54 12.7,2.54 arc90 13.97,3.81 JP8.3
XTAL1
  Layer3 0.305: Q3.2 68.58,13.97 arc90 67.31,15.24 C6.1 arc-90 62.23,16.51 U1.13
XTAL2
  Layer3 0.305: Q3.1 arc-90 68.45,7.62 C5.1 60.96,7.62 arc-90 59.69,8.89 U1.12
~RESET
  Layer2 0.305: U1.9 52.07,19.05 arc90 53.34,17.78 58.42,17.78 arc-90 59.69,16.51 59.69,6.35 arc-90 JP3.9

### Text on the board
tPlace: +5V | GND | DGND | DOUT | +5V | GND | DGND | DOUT | +5V | GND | DGND | DOUT | +5V | GND | DGND | DOUT | GND O | +5V O | +5V I | GND I | VCC | GND | 1 | - | 1 | 1 | + | Lighting controller v1.1 2014/08 djm